# Altium schematic sheet Additional Circuits - Handheld - Rev 3a.SchDoc: Secure Handheld J1939 Logger
size Letter; Author: Dr. Jeremy Daily; CompanyName: The University of Tulsa; Organization: Mechanical Engineering; Address1: 800 S. Tucker Dr.; Address2: Tulsa, OK 74104; DocumentNumber: Wifi, J1708, USB, and Dsub; Revision: 3a; SheetNumber: 2; SheetTotal: 2
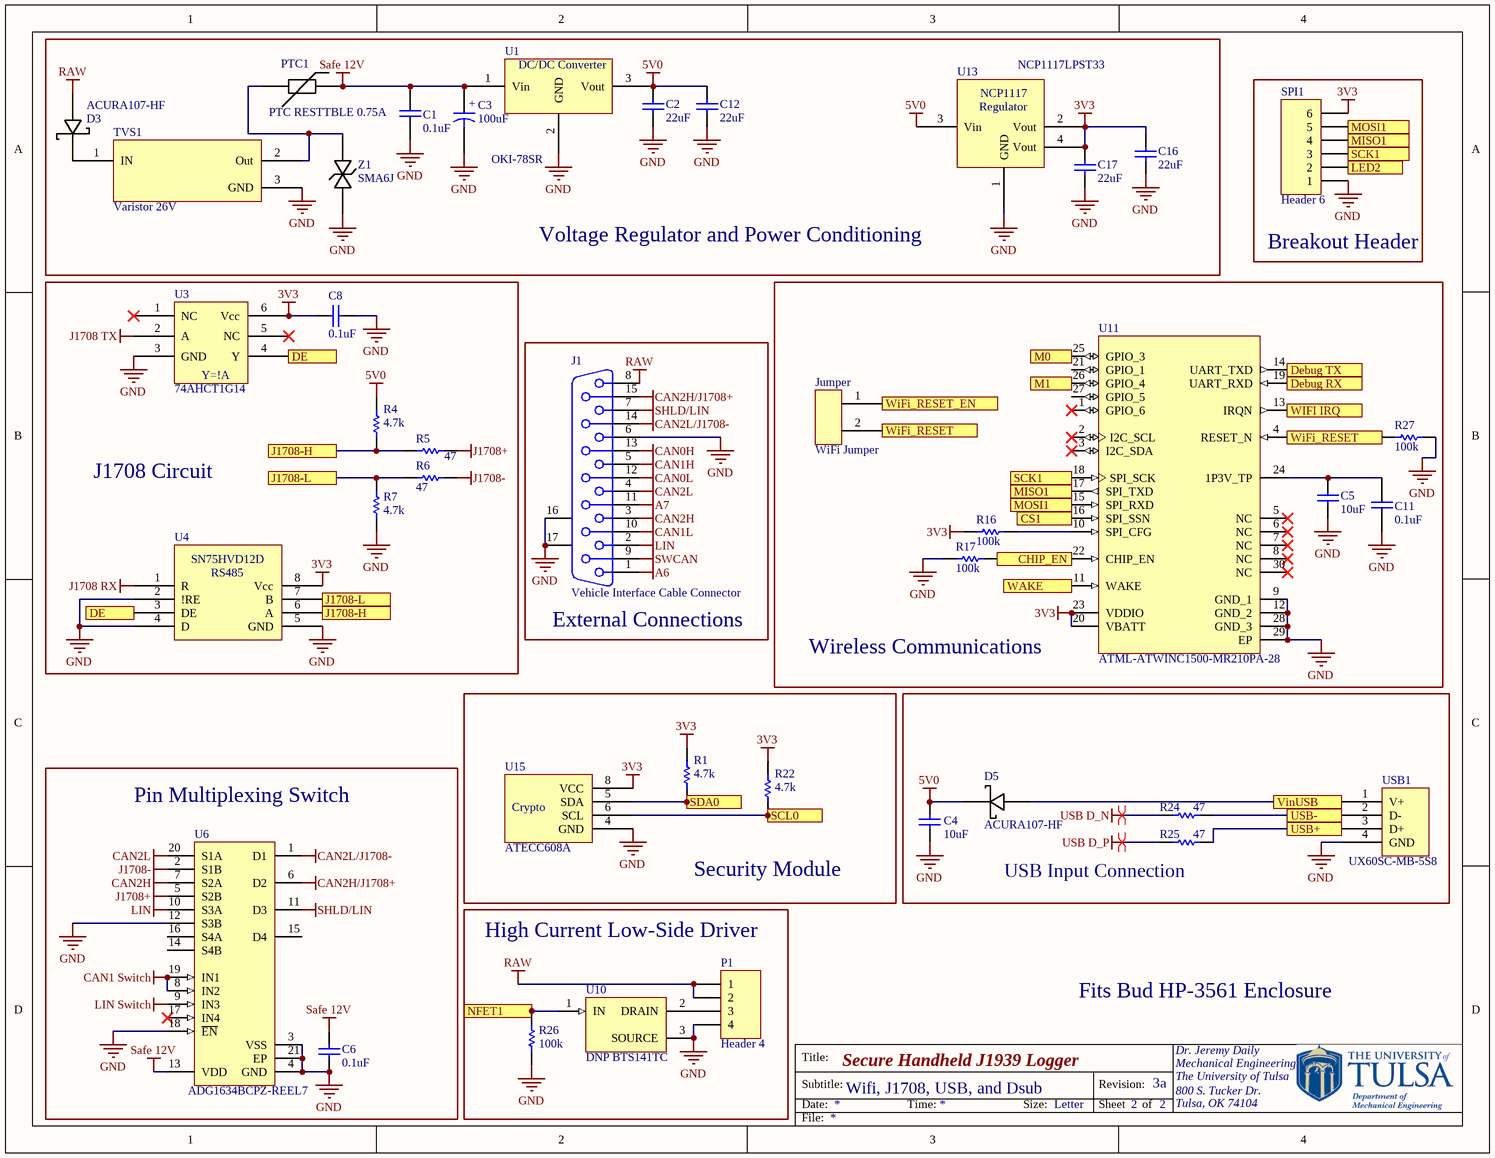
[diagram p0: Additional Circuits - Handheld - Rev 3a.SchDoc]

## Parts
C1  0.1uF  [0603]
C2  22uF  [1206]
C3  100uF  [Elec. Cap - G]
C4  10uF  [0603]
C5  10uF  [0603]
C6  0.1uF  [0603]
C8  0.1uF  [0603]
C11  0.1uF  [0603]
C12  22uF  [1206]
C16  22uF  [1206]
C17  22uF  [1206]
D3  ACURA107-HF  [SMA with A and K]
D5  ACURA107-HF  [SMA with A and K]
J1  Vehicle Interface Cable Connector  [DSUB1.385-2H15]
Jumper  WiFi Jumper  [WiFi Jumper]
P1  Header 4  [HDR1X4]
PTC1  PTC RESTTBLE 0.75A  [1812]
R1  4.7k  [0603]
R4  4.7k  [0603]
R5  47  [0603]
R6  47  [0603]
R7  4.7k  [0603]
R16  100k  [0603]
R17  100k  [0603]
R22  4.7k  [0603]
R24  47  [0603]
R25  47  [0603]
R26  100k  [0603]
R27  100k  [0603]
SPI1  Header 6  [HDR1X6]
TVS1  Varistor 26V  [Transfeed]
U1  OKI-78SR  [OKI-78SR]
U3  74AHCT1G14  [SOT-353]
U4  SN75HVD08DR  [SOIC-SN8_N]  (value not drawn)
U6  ADG1634BCPZ-REEL7  [ADI-CP-20-4_N]
U10  DNP BTS141TC  [INF-PG-TO263-3-2_N]
U11  ATML-ATWINC1500-MR210PA-28  [ATML-ATWINC1500-MR210PA-28_V]
U13  NCP1117LPST33  [SOT-223]
U15  ATECC608A  [SOIC-8]
USB1  UX60SC-MB-5S8  [USB Mini UX60S]
Z1  SMA6J  [SMA]

## Blocks framed on the sheet
Voltage Regulator and Power Conditioning: C1-C3 C12 C16 C17 D3 PTC1 TVS1 U1 U13 Z1
Breakout Header: SPI1
J1708 Circuit: C8 R4-R7 U3 U4
Wireless Communications: C5 C11 Jumper R16 R17 R27 U11
External Connections: J1
Security Module: R1 R22 U15
USB Input Connection: C4 D5 R24 R25 USB1
Pin Multiplexing Switch: C6 U6
High Current Low-Side Driver: P1 R26 U10

## Ports
CHIP_EN, CS1, DE, Debug RX, Debug TX, J1708-H, J1708-L, LED2, M0, M1, MISO1, MOSI1, NFET1, SCK1, SCL0, SDA0, USB+, USB-, VinUSB, WAKE, WIFI IRQ, WiFi_RESET, WiFi_RESET_EN

## Nets
3V3: C8.2 C16.2 C17.2 R1.1 R16.2 R22.1 SPI1.6 U3.6(Vcc) U4.8(Vcc) U11.20(VBATT) U11.23(VDDIO) U13.2(Vout) U13.4(Vout) U15.8(VCC)
5V0: C2.2 C4.1 C12.2 D5.2(K) R4.1 U1.3(Vout) U13.3(Vin)
A6: J1.1
A7: J1.11
CAN0H: J1.13
CAN0L: J1.12
CAN1 Switch: U6.8(IN2) U6.19(IN1)
CAN1H: J1.5
CAN1L: J1.10
CAN2H: J1.3 U6.7(S2A)
CAN2H/J1708+: J1.15 U6.6(D2)
CAN2L: J1.4 U6.20(S1A)
CAN2L/J1708-: J1.14 U6.1(D1)
GND: C1.1 C2.1 C3.2(-) C4.2 C5.1 C6.1 C8.1 C11.1 C12.1 C16.1 C17.1 J1.6 J1.16(MH1) J1.17(MH2) P1.4 R7.2 R17.2 R26.2 R27.1 SPI1.1 TVS1.3(GND) U1.2(GND) U3.3(GND) U4.2(!RE) U4.4(D) U4.5(GND) U6.3(VSS) U6.4(GND) U6.12(S3B) U6.18(~{EN}) U6.21(EP) U10.3(SOURCE) U11.9(GND_1) U11.12(GND_2) U11.28(GND_3) U11.29(EP) U13.1(GND) U15.4(GND) USB1.4(GND) Z1.1(A)
J1708 RX: U4.1(R)
J1708 TX: U3.2(A)
J1708+: R5.2 U6.5(S2B)
J1708-: R6.2 U6.2(S1B)
LIN: J1.2 U6.10(S3A)
LIN Switch: U6.9(IN3)
RAW: D3.1(A) J1.8 P1.1 P1.2
Safe 12V: C1.2 C3.1 C6.2 PTC1.2 U1.1(Vin) U6.13(VDD)
SHLD/LIN: J1.7 U6.11(D3)
SWCAN: J1.9
USB D_N: R24.1
USB D_P: R25.1
CHIP_EN: R17.1 U11.22(CHIP_EN) ; port CHIP_EN
CS1: U11.16(SPI_SSN) ; port CS1
DE: U3.4(Y) U4.3(DE) ; port DE
Debug RX: U11.19(UART_RXD) ; port Debug RX
Debug TX: U11.14(UART_TXD) ; port Debug TX
J1708-H: R4.2 R5.1 U4.6(A) ; port J1708-H
J1708-L: R6.1 R7.1 U4.7(B) ; port J1708-L
LED2: SPI1.2 ; port LED2
M0: U11.25(GPIO_3) ; port M0
M1: U11.26(GPIO_4) ; port M1
MISO1: SPI1.4 U11.17(SPI_TXD) ; port MISO1
MOSI1: SPI1.5 U11.15(SPI_RXD) ; port MOSI1
NFET1: R26.1 U10.1(IN) ; port NFET1
SCK1: SPI1.3 U11.18(SPI_SCK) ; port SCK1
SCL0: R22.2 U15.6(SCL) ; port SCL0
SDA0: R1.2 U15.5(SDA) ; port SDA0
USB+: R25.2 USB1.3(D+) ; port USB+
USB-: R24.2 USB1.2(D-) ; port USB-
VinUSB: D5.1(A) USB1.1(V+) ; port VinUSB
WAKE: U11.11(WAKE) ; port WAKE
WIFI IRQ: U11.13(IRQN) ; port WIFI IRQ
WiFi_RESET: Jumper.2 R27.2 U11.4(RESET_N) ; port WiFi_RESET
WiFi_RESET_EN: Jumper.1 ; port WiFi_RESET_EN
NetC5_2: C5.2 C11.2 U11.24(1P3V_TP)
NetD3_2: D3.2(K) TVS1.1(IN)
NetP1_3: P1.3 U10.2(DRAIN)
NetPTC1_1: PTC1.1 TVS1.2(Out) Z1.2(K)
NetR16_1: R16.1 U11.10(SPI_CFG)

Not connected (* = marked no-connect by the designer): U3 1(NC)* 5(NC)*; U6 14(S4B) 15(D4) 16(S4A) 17(IN4)*; U11 1(GPIO_6)* 2(I2C_SCL)* 3(I2C_SDA)* 5(NC)* 6(NC)* 7(NC)* 8(NC)* 21(GPIO_1) 27(GPIO_5) 30(NC)*

## Layout directives
differential pair: USB D_N, USB D_P

## Notes on the sheet
- Fits Bud HP-3561 Enclosure
- Title:
- Subtitle:
- Date:
- Time:
- Size:
- Letter
- Revision:
- Sheet
- of
- File:
- (in symbol 74AHCT1G14 Inverter) Y=!A
- (in symbol 7805) DC/DC Converter
- (in symbol ATECC508A) Crypto
- (in symbol NCP1117 2.5V) NCP1117; Regulator
- (in symbol SN75HVD12D (3.3v RS485)) SN75HVD12D; RS485
- (in symbol Tantalum Cap_1) +

## Library data of the parts
C1 C11 = Cap: CAP CER 0.1UF 50V X7R 0603; Manufacturer: KEMET; PartNumber: C0603C104K5RACAUTO; Supplier 1: Digi-Key; Supplier Part Number 1: 399-6856-1-ND
C2 C12 C16 C17 = Cap: 22µF ±20% 25V Ceramic Capacitor X5R 1206 (3216 Metric); Manufacturer: Murata Electronics North America; PartNumber: GRT31CR61E226ME01L; Supplier 1: Digi-Key; Supplier Part Number 1: 490-12451-1-ND
C3 = Tantalum Cap_1: Aluminum Electrolytic Capacitors Radial, Can - SMD 5000 Hrs @ 105°C; Manufacturer: Panasonic Electronic Components; PartNumber: EEE-HC1H101P; Supplier 1: Digi-Key; Supplier Part Number 1: P19732CT-ND
C4 C5 = Cap: 10µF ±20% 25V Ceramic Capacitor X5R 0603 (1608 Metric); Manufacturer: Murata Electronics North America; PartNumber: ZRB18AR61E106ME01L; Supplier 1: Digi-Key; Supplier Part Number 1: 490-10991-1-ND
C6 C8 = Cap: CAP CER 0.1UF 50V 10% X7R 0603; Manufacturer: KEMET; PartNumber: C0603C104K5RACAUTO; Supplier 1: Digi-Key; Supplier Part Number 1: 399-6856-1-ND
D3 D5 = Schottky Diode: Diode Schottky 1000V 1A Surface Mount DO-214AC (SMA); Manufacturer: Comchip Technology; Supplier 1: Digi-Key; Supplier Part Number 1: 641-1884-1-ND; PartNumber: ACURA107-HF
J1 = D Connector 15: Receptacle Assembly, 15 Position, Right Angle; Manufacturer: Amphenol FCI; PartNumber: D15S33E4GV00LF; Supplier 1: Digi-Key; Supplier Part Number 1: 609-1498-ND
P1 = Header 4: Header, 4-Pin
PTC1 = PTC: PTC RESTTBLE 0.75A 33V CHIP 1812; Manufacturer: Bel Fuse Inc.; PartNumber: 0ZCG0075BF2B; Supplier 1: Digi-Key; Supplier Part Number 1: 507-1765-1-ND
R1 R4 R7 R22 = Chip Resistor: ±1% 0.1W, 1/10W Chip Resistor 0603 (1608 Metric) Automotive AEC-Q200, High Voltage Thick Film; Manufacturer: Rohm Semiconductor; PartNumber: KTR03EZPF4701; Supplier 1: Digi-Key; Supplier Part Number 1: RHM4.7KAYCT-ND
R5 R6 R24 R25 = Chip Resistor: ±1% 0.1W, 1/10W Chip Resistor 0603 (1608 Metric) Automotive AEC-Q200, High Voltage Thick Film; Manufacturer: Rohm Semiconductor; PartNumber: KTR03EZPF47R0; Supplier 1: Digi-Key; Supplier Part Number 1: RHM47AYCT-ND
R16 R17 R26 R27 = Chip Resistor: ±1% 0.1W, 1/10W Chip Resistor 0603 (1608 Metric) Automotive AEC-Q200, High Voltage Thick Film; Manufacturer: Rohm Semiconductor; PartNumber: KTR03EZPF1003; Supplier 1: Digi-Key; Supplier Part Number 1: RHM100KAYCT-ND
SPI1 = Header 6: Header, 6-Pin
TVS1 = Transfeed: 34.5V 80A Varistor 1 Circuit Surface Mount 0805 (2012 Metric); Manufacturer: AVX; PartNumber: V2AF126C600Y2EDP; Supplier 1: Digi-Key; Supplier Part Number 1: 478-10038-1-ND
U1 = 7805: 5V DC/DC Converter (7805 replacement); Manufacturer: Murata Power Solutions Inc.; PartNumber: OKI-78SR-5/1.5-W36H-C; Supplier 1: Digi-Key; Supplier Part Number 1: 811-2692-ND
U3 = 74AHCT1G14 Inverter: IC SCHMIT-TRIGG INV GATE SOT353; Manufacturer: Diodes Incorporated; PartNumber: 74AHCT1G14SE-7; Supplier 1: Digi-Key; Supplier Part Number 1: 74AHCT1G14SE-7DICT-ND
U4 = SN75HVD12D (3.3v RS485): IC RS485 TXRX 3/5V 8-SOIC; Manufacturer: Texas Instruments; PartNumber: SN75HVD08DR; Supplier 1: Digi-Key; Supplier Part Number 1: 296-37893-1-ND
U6 = ADG1634BCPZ-REEL7: IC SWITCH QUAD SPDT 20LFCSP; Manufacturer: Analog Devices; Supplier 1: Digi-Key; Supplier Part Number 1: ADG1634BCPZ-REEL7CT-ND; PartNumber: ADG1634BCPZ-REEL7
U10 = BTS141TC: Smart Low-Side Power Switch HITFET, 60 V VDS, 12 A ID, -40 to 150 degC, PG-TO263-3-2, Reel, Green; Manufacturer: Infineon; PartNumber: BTS141TCBUMA1; Supplier 1: Digi-Key; Supplier Part Number 1: BTS141TCBUMA1CT-ND
U11 = ATML-ATWINC1500-MR210PA-28: SMARTCONNECT ATWINC1500B-MU-T MO; Manufacturer: Microchip Technologies; PartNumber: ATWINC1510-MR210PB1140; Supplier 1: Digi-Key; Supplier Part Number 1: ATWINC1510-MR210PB1140-ND
U13 = NCP1117 2.5V: Linear Voltage Regulator IC Positive Fixed Output 3.3V 1A SOT-223; Manufacturer: On Semiconductor; PartNumber: NCP1117LPST33T3G; Supplier 1: Digi-Key; Supplier Part Number 1: NCP1117LPST33T3GOSCT-ND
U15 = ATECC508A: Authentication Chip IC Networking and Communications 8-SOIC; Manufacturer: Microchip Technology; PartNumber: ATECC608A-SSHCZ-T; Supplier Part Number 1: ATECC608A-SSHCZ-TCT-ND; Supplier 1: Digi-Key
USB1 = USB-Rugged: USB - mini B USB 2.0 Receptacle Connector 5 Position Surface Mount, Right Angle; Through Hole; Manufacturer: Hirose; Supplier 1: Digi-Key; Supplier Part Number 1: H11589CT-ND; PartNumber: UX60SC-MB-5S8
Z1 = Zener - Bidirectional: TVS DIODE 20VWM 36.8VC SMA; Manufacturer: Micro Commercial Co; PartNumber: SMA6J24CA-TP; Supplier 1: Digi-Key; Supplier Part Number 1: SMA6J24CA-TPMSCT-ND